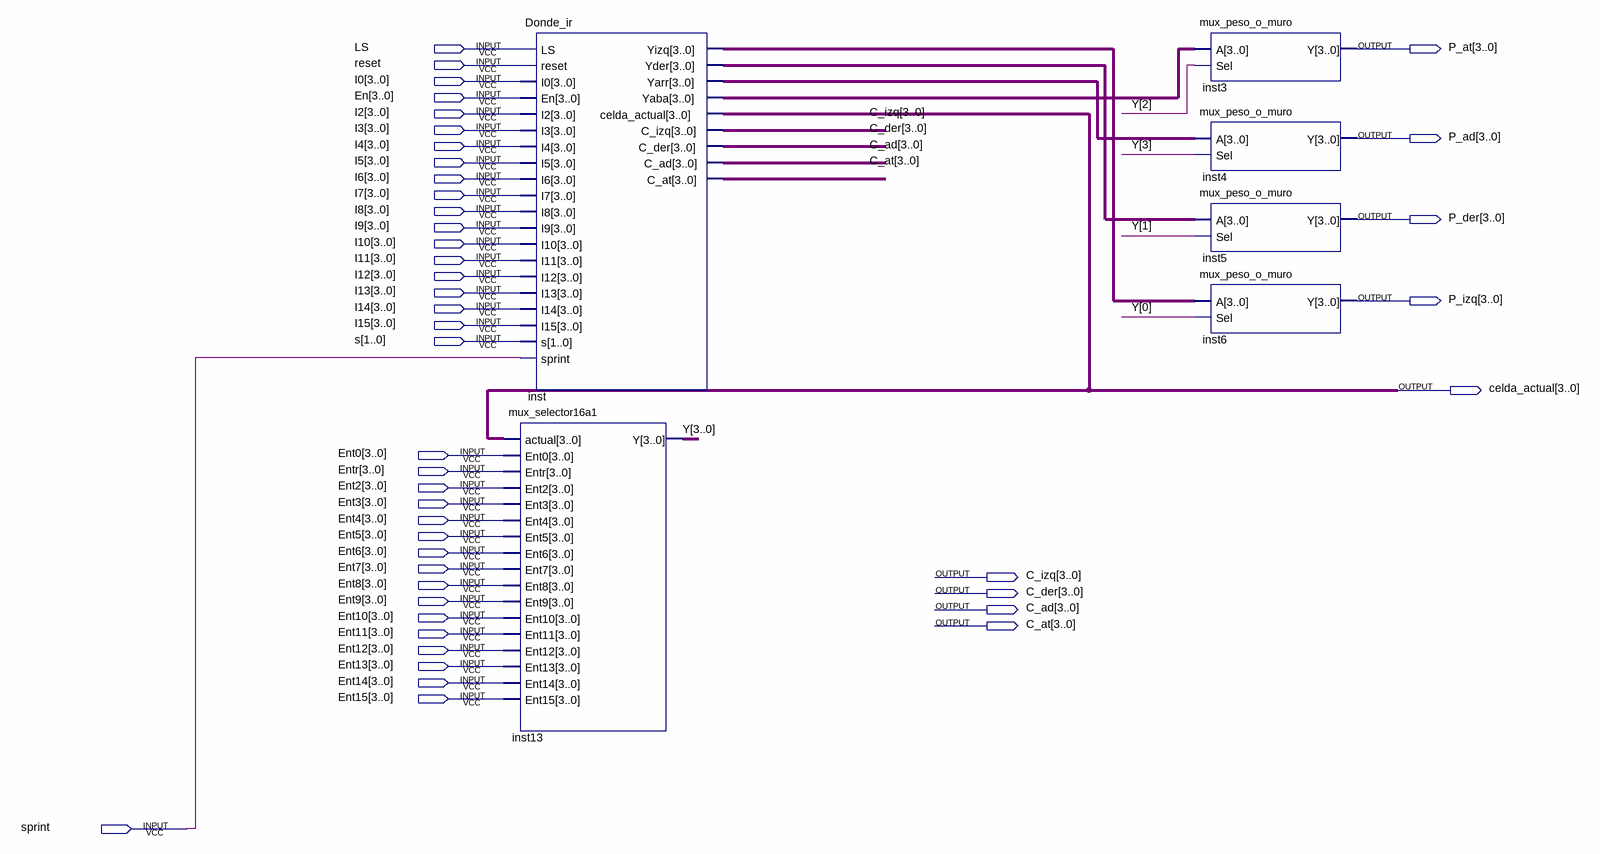
[diagram p0: schematic sheet]
// Quartus schematic Muro_o_peso.bdf as structural Verilog: 6 symbols, 45 pins
module Muro_o_peso (
  input  LS,
  input  reset,
  input  [3:0] I0,
  input  [3:0] En,
  input  [3:0] I2,
  input  [3:0] I3,
  input  [3:0] I4,
  input  [3:0] I5,
  input  [3:0] I6,
  input  [3:0] I7,
  input  [3:0] I8,
  input  [3:0] I9,
  input  [3:0] I10,
  input  [3:0] I11,
  input  [3:0] I12,
  input  [3:0] I13,
  input  [3:0] I14,
  input  [3:0] I15,
  input  [1:0] s,
  input  [3:0] Ent0,
  input  [3:0] Entr,
  input  [3:0] Ent2,
  input  [3:0] Ent3,
  input  [3:0] Ent4,
  input  [3:0] Ent5,
  input  [3:0] Ent6,
  input  [3:0] Ent7,
  input  [3:0] Ent8,
  input  [3:0] Ent9,
  input  [3:0] Ent10,
  input  [3:0] Ent11,
  input  [3:0] Ent12,
  input  [3:0] Ent13,
  input  [3:0] Ent14,
  input  [3:0] Ent15,
  input  sprint,
  output [3:0] P_at,
  output [3:0] P_ad,
  output [3:0] P_der,
  output [3:0] P_izq,
  output [3:0] celda_actual,
  output [3:0] C_izq,
  output [3:0] C_der,
  output [3:0] C_ad,
  output [3:0] C_at
);

  wire [3:0] inst_yaba, inst_yarr, inst_yder, inst_yizq, Y;

  Donde_ir inst (
    .LS(LS), .reset(reset), .I0(I0), .En(En), .I2(I2), .I3(I3), .I4(I4), .I5(I5), .I6(I6), .I7(I7), .I8(I8),
    .I9(I9), .I10(I10), .I11(I11), .I12(I12), .I13(I13), .I14(I14), .I15(I15), .s(s), .sprint(sprint),
    .Yizq(inst_yizq), .Yder(inst_yder), .Yarr(inst_yarr), .Yaba(inst_yaba), .celda_actual(celda_actual),
    .C_izq(C_izq), .C_der(C_der), .C_ad(C_ad), .C_at(C_at));
  mux_selector16a1 inst13 (
    .actual(celda_actual), .Ent0(Ent0), .Entr(Entr), .Ent2(Ent2), .Ent3(Ent3), .Ent4(Ent4), .Ent5(Ent5),
    .Ent6(Ent6), .Ent7(Ent7), .Ent8(Ent8), .Ent9(Ent9), .Ent10(Ent10), .Ent11(Ent11), .Ent12(Ent12),
    .Ent13(Ent13), .Ent14(Ent14), .Ent15(Ent15), .Y(Y));
  mux_peso_o_muro inst3 (.A(inst_yaba), .Sel(Y[2]), .Y(P_at));
  mux_peso_o_muro inst4 (.A(inst_yarr), .Sel(Y[3]), .Y(P_ad));
  mux_peso_o_muro inst5 (.A(inst_yder), .Sel(Y[1]), .Y(P_der));
  mux_peso_o_muro inst6 (.A(inst_yizq), .Sel(Y[0]), .Y(P_izq));
endmodule
